# EAGLE schematic M168A (EAGLE 6.6.0)
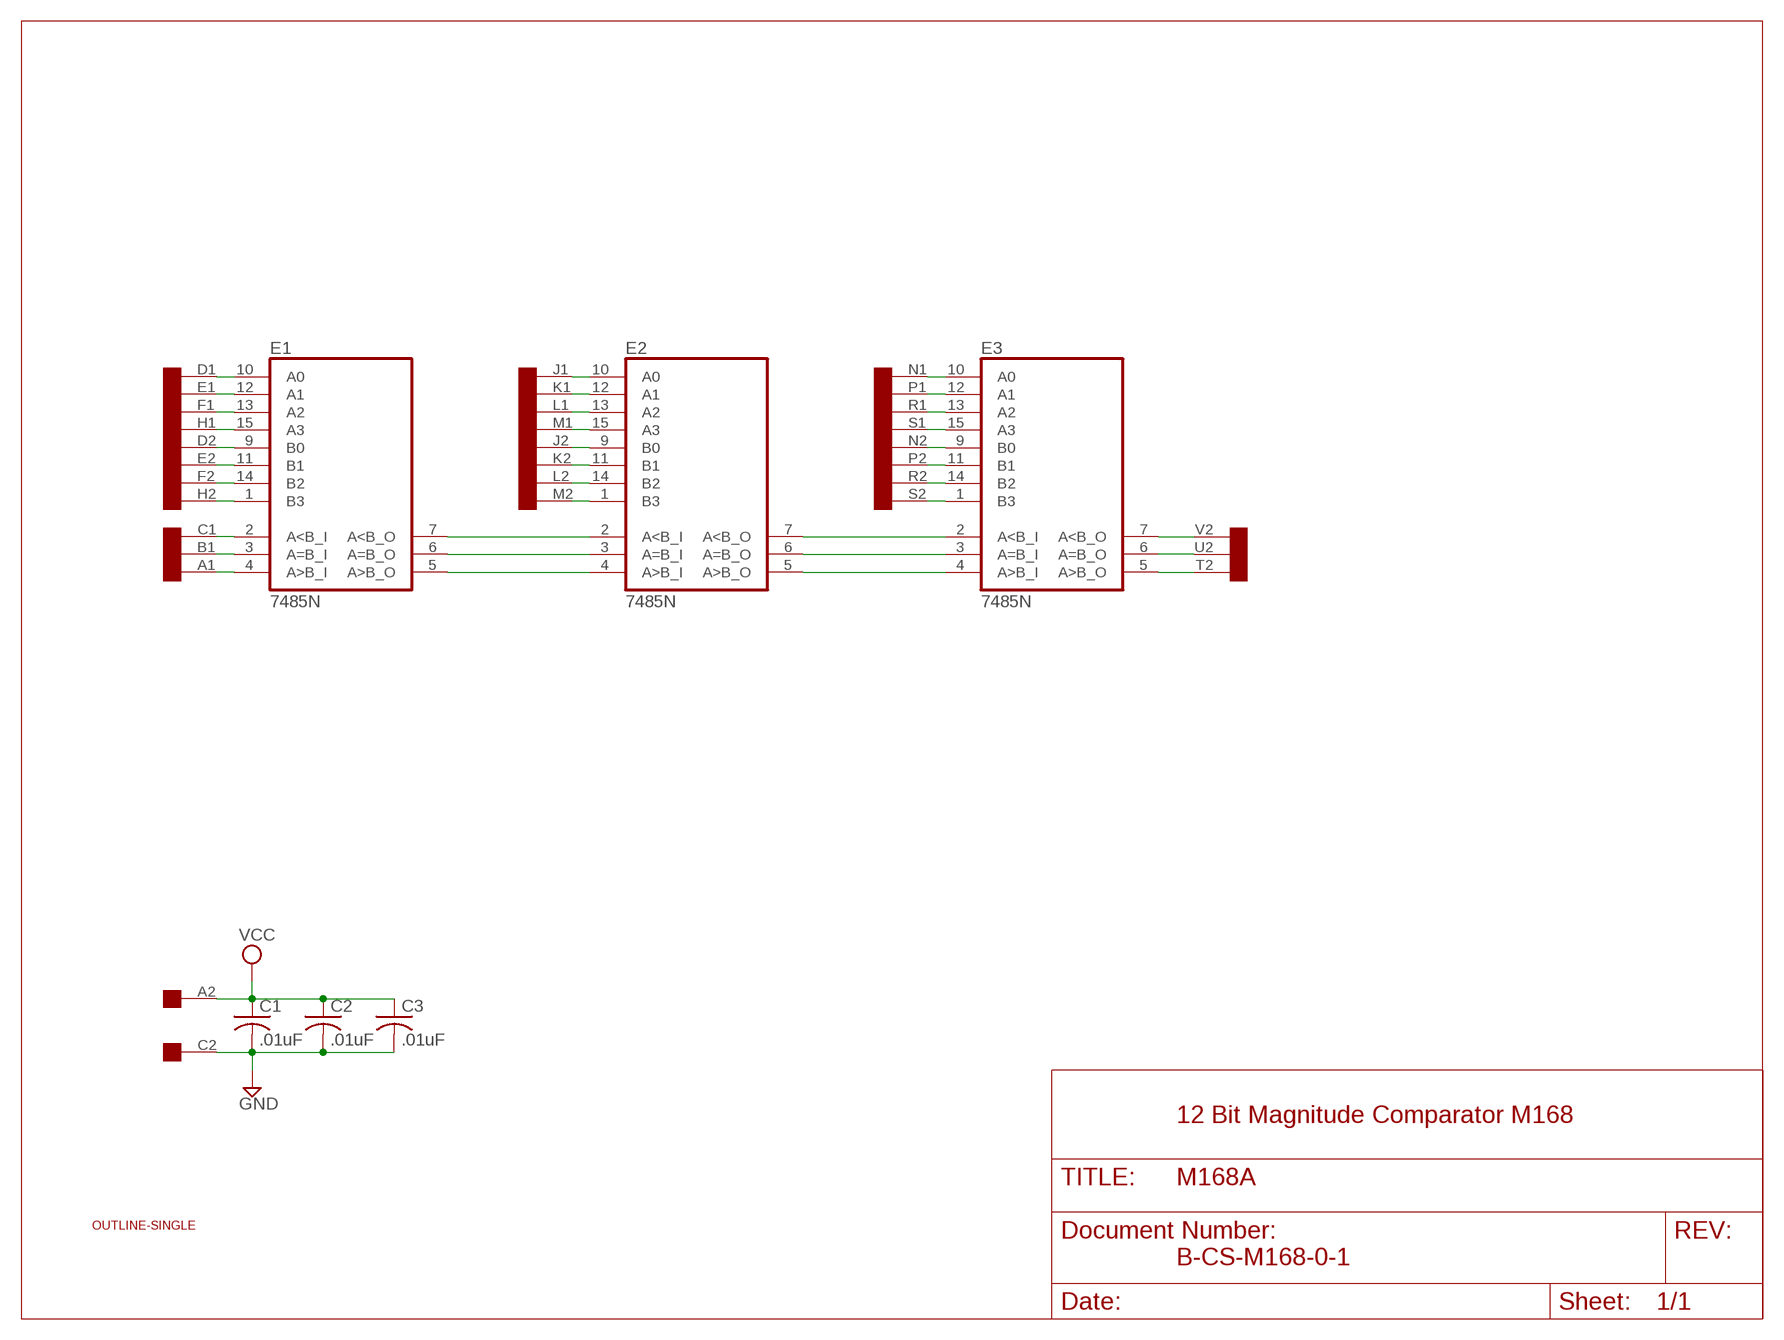
[diagram p0: schematic, sheet 1]

## Parts
C1  .01uF  C-US050-025X075  [C050-025X075]
C2  .01uF  C-US050-025X075  [C050-025X075]
C3  .01uF  C-US050-025X075  [C050-025X075]
E1  7485N  [DIL16]
E2  7485N  [DIL16]
E3  7485N  [DIL16]
U$1  SINGLE  [EDGE-CON2]
U$2  OUTLINE-SINGLE  [SINGLE]

## Nets
A1: E1.4(A>B_I) U$1.A1
B1: E1.3(A=B_I) U$1.B1
C1: E1.2(A<B_I) U$1.C1
D1: E1.10(A0) U$1.D1
D2: E1.9(B0) U$1.D2
E1: E1.12(A1) U$1.E1
E2: E1.11(B1) U$1.E2
F1: E1.13(A2) U$1.F1
F2: E1.14(B2) U$1.F2
GND [supply]: C1.2 C2.2 C3.2 U$1.C2
H1: E1.15(A3) U$1.H1
H2: E1.1(B3) U$1.H2
J1: E2.10(A0) U$1.J1
J2: E2.9(B0) U$1.J2
K1: E2.12(A1) U$1.K1
K2: E2.11(B1) U$1.K2
L1: E2.13(A2) U$1.L1
L2: E2.14(B2) U$1.L2
M1: E2.15(A3) U$1.M1
M2: E2.1(B3) U$1.M2
N1: E3.10(A0) U$1.N1
N2: E3.9(B0) U$1.N2
N$32: E1.6(A=B_O) E2.3(A=B_I)
N$33: E1.7(A<B_O) E2.2(A<B_I)
N$34: E1.5(A>B_O) E2.4(A>B_I)
N$46: E2.6(A=B_O) E3.3(A=B_I)
N$47: E2.7(A<B_O) E3.2(A<B_I)
N$48: E2.5(A>B_O) E3.4(A>B_I)
P1: E3.12(A1) U$1.P1
P2: E3.11(B1) U$1.P2
R1: E3.13(A2) U$1.R1
R2: E3.14(B2) U$1.R2
S1: E3.15(A3) U$1.S1
S2: E3.1(B3) U$1.S2
T2: E3.5(A>B_O) U$1.T2
U2: E3.6(A=B_O) U$1.U2
V2: E3.7(A<B_O) U$1.V2
VCC [supply]: C1.1 C2.1 C3.1 U$1.A2
Unconnected: U$1.B2 U$1.T1 U$1.U1 U$1.V1

## Notes on the sheet
- 12 Bit Magnitude Comparator M168
- B-CS-M168-0-1

## Power pins joined to a net without a drawn wire
GND: E1.8(GND) E2.8(GND) E3.8(GND)
VCC: E1.16(VCC) E2.16(VCC) E3.16(VCC)

## Library data of the parts
C1-C3 = rcl:C-US: CAPACITOR, American symbol
E1-E3 = 74xx-us:74*85: 4-bit magnitude COMPARATOR
U$1 = dec-con:SINGLE: Single-Height DEC board
U$2 = dec-con:OUTLINE-*: Board outlines for DEC boards.

## Net classes
1 supply: width 0.813 mm